# Altium project main_Bord.PrjPcb
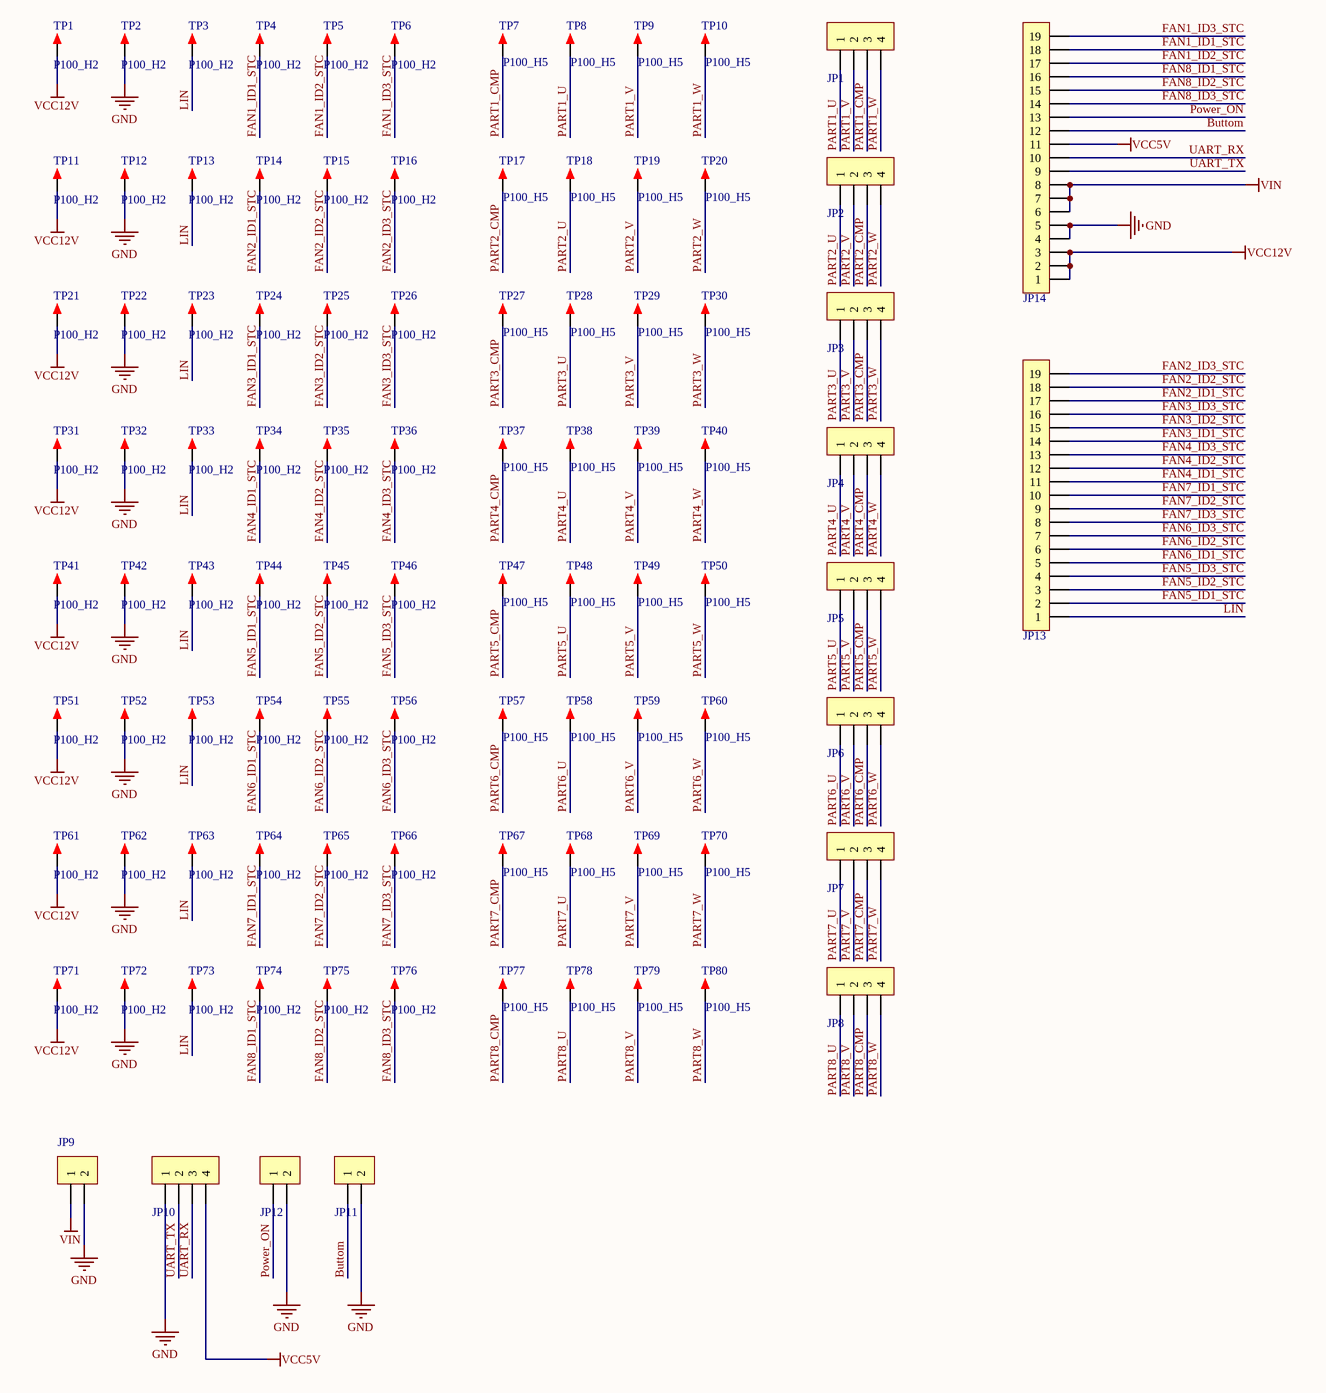
[diagram p0: Sheet1.SchDoc]
1 sheet, 94 parts. Net scope: global (net labels, ports and power ports of the same name join across sheets).
Board file: main_Bord.PcbDoc

## Sheet Sheet1.SchDoc
size 629 x 289 mm; SheetNumber: 1; SheetTotal: 1

### Parts
JP1  HDR-1X4  [XH2.54-WS-4P]  (value not drawn)
JP2  HDR-1X4  [XH2.54-WS-4P]  (value not drawn)
JP3  HDR-1X4  [XH2.54-WS-4P]  (value not drawn)
JP4  HDR-1X4  [XH2.54-WS-4P]  (value not drawn)
JP5  HDR-1X4  [XH2.54-WS-4P]  (value not drawn)
JP6  HDR-1X4  [XH2.54-WS-4P]  (value not drawn)
JP7  HDR-1X4  [XH2.54-WS-4P]  (value not drawn)
JP8  HDR-1X4  [XH2.54-WS-4P]  (value not drawn)
JP9  HDR-1X2  [DC-005P]  (value not drawn)
JP10  HDR-1X4  [XH2.54-WS-4P]  (value not drawn)
JP11  HDR-1X2  [XH2.54-WS-2P]  (value not drawn)
JP12  HDR-1X2  [XH2.54-WS-2P]  (value not drawn)
JP13  HDR-1X19  [贴片排针2.54mm_交错_19P]  (value not drawn)
JP14  HDR-1X19  [贴片排针2.54mm_交错_19P]  (value not drawn)
TP1  P100_H2  [P100_H2]
TP2  P100_H2  [P100_H2]
TP3  P100_H2  [P100_H2]
TP4  P100_H2  [P100_H2]
TP5  P100_H2  [P100_H2]
TP6  P100_H2  [P100_H2]
TP7  P100_H5  [P100_H5]
TP8  P100_H5  [P100_H5]
TP9  P100_H5  [P100_H5]
TP10  P100_H5  [P100_H5]
TP11  P100_H2  [P100_H2]
TP12  P100_H2  [P100_H2]
TP13  P100_H2  [P100_H2]
TP14  P100_H2  [P100_H2]
TP15  P100_H2  [P100_H2]
TP16  P100_H2  [P100_H2]
TP17  P100_H5  [P100_H5]
TP18  P100_H5  [P100_H5]
TP19  P100_H5  [P100_H5]
TP20  P100_H5  [P100_H5]
TP21  P100_H2  [P100_H2]
TP22  P100_H2  [P100_H2]
TP23  P100_H2  [P100_H2]
TP24  P100_H2  [P100_H2]
TP25  P100_H2  [P100_H2]
TP26  P100_H2  [P100_H2]
TP27  P100_H5  [P100_H5]
TP28  P100_H5  [P100_H5]
TP29  P100_H5  [P100_H5]
TP30  P100_H5  [P100_H5]
TP31  P100_H2  [P100_H2]
TP32  P100_H2  [P100_H2]
TP33  P100_H2  [P100_H2]
TP34  P100_H2  [P100_H2]
TP35  P100_H2  [P100_H2]
TP36  P100_H2  [P100_H2]
TP37  P100_H5  [P100_H5]
TP38  P100_H5  [P100_H5]
TP39  P100_H5  [P100_H5]
TP40  P100_H5  [P100_H5]
TP41  P100_H2  [P100_H2]
TP42  P100_H2  [P100_H2]
TP43  P100_H2  [P100_H2]
TP44  P100_H2  [P100_H2]
TP45  P100_H2  [P100_H2]
TP46  P100_H2  [P100_H2]
TP47  P100_H5  [P100_H5]
TP48  P100_H5  [P100_H5]
TP49  P100_H5  [P100_H5]
TP50  P100_H5  [P100_H5]
TP51  P100_H2  [P100_H2]
TP52  P100_H2  [P100_H2]
TP53  P100_H2  [P100_H2]
TP54  P100_H2  [P100_H2]
TP55  P100_H2  [P100_H2]
TP56  P100_H2  [P100_H2]
TP57  P100_H5  [P100_H5]
TP58  P100_H5  [P100_H5]
TP59  P100_H5  [P100_H5]
TP60  P100_H5  [P100_H5]
TP61  P100_H2  [P100_H2]
TP62  P100_H2  [P100_H2]
TP63  P100_H2  [P100_H2]
TP64  P100_H2  [P100_H2]
TP65  P100_H2  [P100_H2]
TP66  P100_H2  [P100_H2]
TP67  P100_H5  [P100_H5]
TP68  P100_H5  [P100_H5]
TP69  P100_H5  [P100_H5]
TP70  P100_H5  [P100_H5]
TP71  P100_H2  [P100_H2]
TP72  P100_H2  [P100_H2]
TP73  P100_H2  [P100_H2]
TP74  P100_H2  [P100_H2]
TP75  P100_H2  [P100_H2]
TP76  P100_H2  [P100_H2]
TP77  P100_H5  [P100_H5]
TP78  P100_H5  [P100_H5]
TP79  P100_H5  [P100_H5]
TP80  P100_H5  [P100_H5]

### Nets
GND: JP9.2 JP10.1 JP11.2 JP12.2 JP14.4 JP14.5 TP2.1 TP12.1 TP22.1 TP32.1 TP42.1 TP52.1 TP62.1 TP72.1
VCC5V: JP10.4 JP14.11
VCC12V: JP14.1 JP14.2 JP14.3 TP1.1 TP11.1 TP21.1 TP31.1 TP41.1 TP51.1 TP61.1 TP71.1
VIN: JP9.1 JP14.6 JP14.7 JP14.8
Buttom: JP11.1 JP14.12
FAN1_ID1_STC: JP14.18 TP4.1
FAN1_ID2_STC: JP14.17 TP5.1
FAN1_ID3_STC: JP14.19 TP6.1
FAN2_ID1_STC: JP13.17 TP14.1
FAN2_ID2_STC: JP13.18 TP15.1
FAN2_ID3_STC: JP13.19 TP16.1
FAN3_ID1_STC: JP13.14 TP24.1
FAN3_ID2_STC: JP13.15 TP25.1
FAN3_ID3_STC: JP13.16 TP26.1
FAN4_ID1_STC: JP13.11 TP34.1
FAN4_ID2_STC: JP13.12 TP35.1
FAN4_ID3_STC: JP13.13 TP36.1
FAN5_ID1_STC: JP13.2 TP44.1
FAN5_ID2_STC: JP13.3 TP45.1
FAN5_ID3_STC: JP13.4 TP46.1
FAN6_ID1_STC: JP13.5 TP54.1
FAN6_ID2_STC: JP13.6 TP55.1
FAN6_ID3_STC: JP13.7 TP56.1
FAN7_ID1_STC: JP13.10 TP64.1
FAN7_ID2_STC: JP13.9 TP65.1
FAN7_ID3_STC: JP13.8 TP66.1
FAN8_ID1_STC: JP14.16 TP74.1
FAN8_ID2_STC: JP14.15 TP75.1
FAN8_ID3_STC: JP14.14 TP76.1
LIN: JP13.1 TP3.1 TP13.1 TP23.1 TP33.1 TP43.1 TP53.1 TP63.1 TP73.1
PART1_CMP: JP1.3 TP7.1
PART1_U: JP1.1 TP8.1
PART1_V: JP1.2 TP9.1
PART1_W: JP1.4 TP10.1
PART2_CMP: JP2.3 TP17.1
PART2_U: JP2.1 TP18.1
PART2_V: JP2.2 TP19.1
PART2_W: JP2.4 TP20.1
PART3_CMP: JP3.3 TP27.1
PART3_U: JP3.1 TP28.1
PART3_V: JP3.2 TP29.1
PART3_W: JP3.4 TP30.1
PART4_CMP: JP4.3 TP37.1
PART4_U: JP4.1 TP38.1
PART4_V: JP4.2 TP39.1
PART4_W: JP4.4 TP40.1
PART5_CMP: JP5.3 TP47.1
PART5_U: JP5.1 TP48.1
PART5_V: JP5.2 TP49.1
PART5_W: JP5.4 TP50.1
PART6_CMP: JP6.3 TP57.1
PART6_U: JP6.1 TP58.1
PART6_V: JP6.2 TP59.1
PART6_W: JP6.4 TP60.1
PART7_CMP: JP7.3 TP67.1
PART7_U: JP7.1 TP68.1
PART7_V: JP7.2 TP69.1
PART7_W: JP7.4 TP70.1
PART8_CMP: JP8.3 TP77.1
PART8_U: JP8.1 TP78.1
PART8_V: JP8.2 TP79.1
PART8_W: JP8.4 TP80.1
Power_ON: JP12.1 JP14.13
UART_RX: JP10.3 JP14.10
UART_TX: JP10.2 JP14.9

### Library data of the parts
JP1-JP8 JP10 = Header 4: 4P接插件; 版权归属: 源创客; BOM名称: 4P接插件; 学习资源: www.ooocke.com
JP9 JP11 JP12 = Header 2: 2P接插件; 版权归属: 源创客; BOM名称: 2P接插件; 学习资源: www.ooocke.com
JP13 JP14 = Header 19: 19P接插件; 版权归属: 源创客; BOM名称: 19P接插件; 学习资源: www.ooocke.com
TP1-TP80 = TEST: 测试点; 版权归属: 源创客; BOM名称: 测试点; 学习资源: www.ooocke.com